# Altium schematic sheet Teensy 3.6 with J1939 - Handheld Rev2.SchDoc: Secure Handheld J1939 Logger
size Letter; Author: Dr. Jeremy Daily; CompanyName: The University of Tulsa; Organization: Mechanical Engineering; Address1: 800 S. Tucker Dr.; Address2: Tulsa, OK 74104; DocumentNumber: Hands-On Heavy Duty Networking; Revision: 1; SheetNumber: 1; SheetTotal: 1
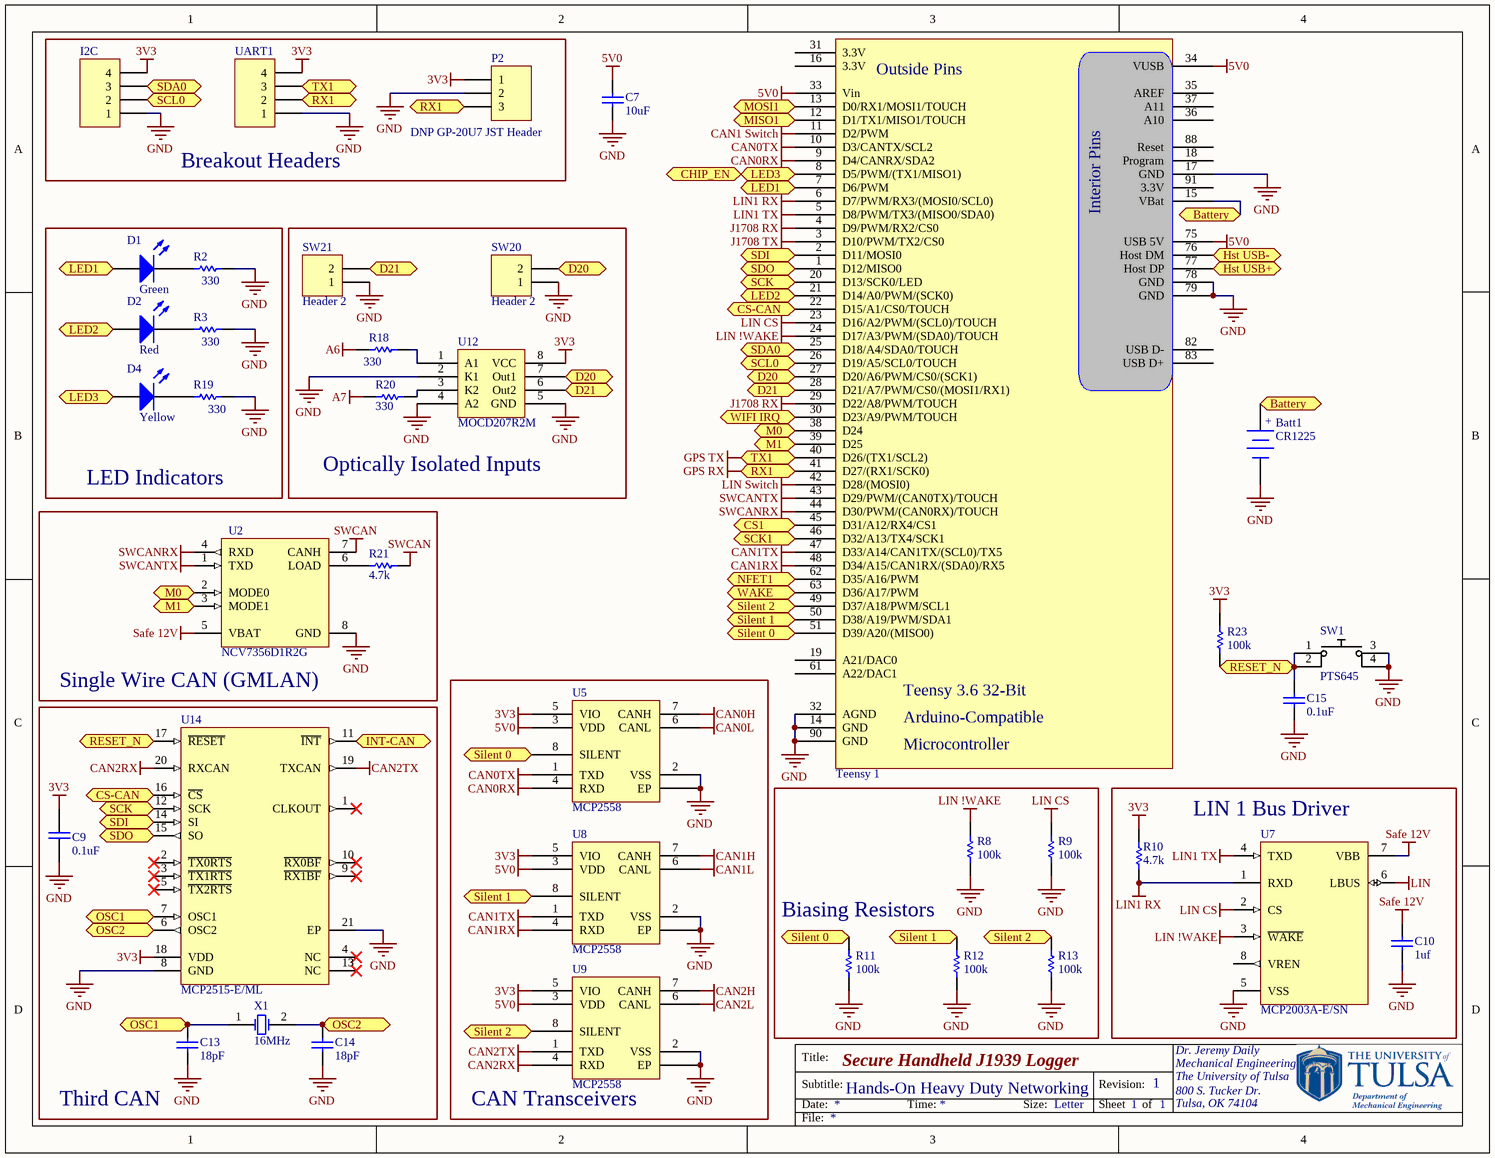
[diagram p0: Teensy 3.6 with J1939 - Handheld Rev2.SchDoc]

## Parts
Batt1  CR1225  [Battery Clip - CR1225]
C7  10uF  [1206]
C9  0.1uF  [0603]
C10  1uf  [0603]
C13  18pF  [0603]
C14  18pF  [0603]
C15  0.1uF  [0603]
D1  Green  [0805 Polarized]
D2  Red  [0805 Polarized]
D4  Yellow  [0805 Polarized]
I2C  Header 4  [HDR1X4]  (value not drawn)
P2  DNP GP-20U7 JST Header  [MHDR1X3]
R2  330  [0603]
R3  330  [0603]
R8  100k  [0603]
R9  100k  [0603]
R10  4.7k  [0603]
R11  100k  [0603]
R12  100k  [0603]
R13  100k  [0603]
R18  330  [0603]
R19  330  [0603]
R20  330  [0603]
R21  4.7k  [0603]
R23  100k  [0603]
SW1  PTS645  [Switch PTS645]
SW20  Header 2  [HDR1X2]
SW21  Header 2  [HDR1X2]
Teensy_1  Teensy 3.6 Through Hole  [Teensy 3.6 Through Hole - No Labels]  (value not drawn)
U2  NCV7356D1R2G  [ONSC-SOIC-8-751-07_V]
U5  MCP2558  [TDFN]
U7  MCP2003A-E/SN  [SOIC-SN8_N]
U8  MCP2558  [TDFN]
U9  MCP2558  [TDFN]
U12  MOCD207R2M  [SOIC-8]
U14  MCP2515-E/ML  [QFN-ML20_M]
UART1  Header 4  [HDR1X4]  (value not drawn)
X1  16MHz  [XTAL 2 pad]

## Blocks framed on the sheet
Breakout Headers: I2C P2 UART1
LED Indicators: D1 D2 D4 R2 R3 R19
Optically Isolated Inputs: R18 R20 SW20 SW21 U12
Single Wire CAN (GMLAN): R21 U2
CAN Transceivers: U5 U8 U9
Third CAN: C9 C13 C14 U14 X1
Biasing Resistors: R8 R9 R11-R13
LIN 1 Bus Driver: C10 R10 U7

## Ports
Battery, CHIP_EN, CS1, CS-CAN, D20, D21, Hst USB+, Hst USB-, INT-CAN, LED1, LED2, LED3, M0, M1, MISO1, MOSI1, NFET1, OSC1, OSC2, RESET_N, RX1, SCK, SCK1, SCL0, SDA0, SDI, SDO, Silent 0, Silent 1, Silent 2, TX1, WAKE, WIFI IRQ

## Nets
3V3: C9.2 I2C.4 P2.1 R10.2 R23.1 U5.5(VIO) U8.5(VIO) U9.5(VIO) U12.8(VCC) U14.18(VDD) UART1.4
5V0: C7.1 Teensy_1.33(Vin) Teensy_1.34(VUSB) Teensy_1.75(USB_5V) U5.3(VDD) U8.3(VDD) U9.3(VDD)
A6: R18.1
A7: R20.1
CAN0H: U5.7(CANH)
CAN0L: U5.6(CANL)
CAN0RX: Teensy_1.9(D4/CANRX/SDA2) U5.4(RXD)
CAN0TX: Teensy_1.10(D3/CANTX/SCL2) U5.1(TXD)
CAN1 Switch: Teensy_1.11(D2/PWM)
CAN1H: U8.7(CANH)
CAN1L: U8.6(CANL)
CAN1RX: Teensy_1.48(D34/A15/CAN1RX/(SDA0)/RX5) U8.4(RXD)
CAN1TX: Teensy_1.47(D33/A14/CAN1TX/(SCL0)/TX5) U8.1(TXD)
CAN2H: U9.7(CANH)
CAN2L: U9.6(CANL)
CAN2RX: U9.4(RXD) U14.20(RXCAN)
CAN2TX: U9.1(TXD) U14.19(TXCAN)
GND: Batt1.2(-) C7.2 C9.1 C10.2 C13.1 C14.1 C15.1 I2C.1 P2.2 R2.2 R3.2 R8.2 R9.2 R11.2 R12.2 R13.2 R19.2 SW1.3 SW1.4 SW20.1 SW21.1 Teensy_1.14(GND) Teensy_1.17(GND) Teensy_1.32(AGND) Teensy_1.78(GND) Teensy_1.79(GND) Teensy_1.90(GND) U2.8(GND) U5.0(EP) U5.2(VSS) U7.5(VSS) U8.0(EP) U8.2(VSS) U9.0(EP) U9.2(VSS) U12.2(K1) U12.4(A2) U12.5(GND) U14.8(GND) U14.21(EP) UART1.1
GPS RX: P2.3 Teensy_1.41(D27/(RX1/SCK0)) UART1.2 ; port RX1
GPS TX: Teensy_1.40(D26/(TX1/SCL2)) UART1.3 ; port TX1
J1708 RX: Teensy_1.4(D9/PWM/RX2/CS0) Teensy_1.29(D22/A8/PWM/TOUCH)
J1708 TX: Teensy_1.3(D10/PWM/TX2/CS0)
LIN: U7.6(LBUS)
LIN1 RX: R10.1 Teensy_1.6(D7/PWM/RX3/(MOSI0/SCL0)) U7.1(RXD)
LIN1 TX: Teensy_1.5(D8/PWM/TX3/(MISO0/SDA0)) U7.4(TXD)
LIN !WAKE: R8.1 Teensy_1.24(D17/A3/PWM/(SDA0)/TOUCH) U7.3(~{WAKE})
LIN CS: R9.1 Teensy_1.23(D16/A2/PWM/(SCL0)/TOUCH) U7.2(CS)
LIN Switch: Teensy_1.42(D28/(MOSI0))
Safe 12V: C10.1 U2.5(VBAT) U7.7(VBB)
SWCAN: R21.2 U2.7(CANH)
SWCANRX: Teensy_1.44(D30/PWM/(CAN0RX)/TOUCH) U2.4(RXD)
SWCANTX: Teensy_1.43(D29/PWM/(CAN0TX)/TOUCH) U2.1(TXD)
Battery: Batt1.1(+) Teensy_1.15(VBat) ; port Battery
CHIP_EN: D4.1(A) Teensy_1.8(D5/PWM/(TX1/MISO1)) ; port LED3, port CHIP_EN
CS1: Teensy_1.45(D31/A12/RX4/CS1) ; port CS1
CS-CAN: Teensy_1.22(D15/A1/CS0/TOUCH) U14.16(~{CS}) ; port CS-CAN
D20: SW20.2 Teensy_1.27(D20/A6/PWM/CS0/(SCK1)) U12.7(Out1) ; port D20
D21: SW21.2 Teensy_1.28(D21/A7/PWM/CS0/(MOSI1/RX1)) U12.6(Out2) ; port D21
Hst USB+: Teensy_1.77(Host_DP) ; port Hst USB+
Hst USB-: Teensy_1.76(Host_DM) ; port Hst USB-
INT-CAN: U14.11(~{INT}) ; port INT-CAN
LED1: D1.1(A) Teensy_1.7(D6/PWM) ; port LED1
LED2: D2.1(A) Teensy_1.21(D14/A0/PWM/(SCK0)) ; port LED2
M0: Teensy_1.38(D24) U2.2(MODE0) ; port M0
M1: Teensy_1.39(D25) U2.3(MODE1) ; port M1
MISO1: Teensy_1.12(D1/TX1/MISO1/TOUCH) ; port MISO1
MOSI1: Teensy_1.13(D0/RX1/MOSI1/TOUCH) ; port MOSI1
NFET1: Teensy_1.62(D35/A16/PWM) ; port NFET1
OSC1: C13.2 U14.7(OSC1) X1.1(OSC1) ; port OSC1
OSC2: C14.2 U14.6(OSC2) X1.2(OSC2) ; port OSC2
RESET_N: C15.2 R23.2 SW1.1 SW1.2 U14.17(~{RESET}) ; port RESET_N
SCK: Teensy_1.20(D13/SCK0/LED) U14.12(SCK) ; port SCK
SCK1: Teensy_1.46(D32/A13/TX4/SCK1) ; port SCK1
SCL0: I2C.2 Teensy_1.26(D19/A5/SCL0/TOUCH) ; port SCL0
SDA0: I2C.3 Teensy_1.25(D18/A4/SDA0/TOUCH) ; port SDA0
SDI: Teensy_1.2(D11/MOSI0) U14.14(SI) ; port SDI
SDO: Teensy_1.1(D12/MISO0) U14.15(SO) ; port SDO
Silent 0: R11.1 Teensy_1.51(D39/A20/(MISO0)) U5.8(SILENT) ; port Silent 0
Silent 1: R12.1 Teensy_1.50(D38/A19/PWM/SDA1) U8.8(SILENT) ; port Silent 1
Silent 2: R13.1 Teensy_1.49(D37/A18/PWM/SCL1) U9.8(SILENT) ; port Silent 2
WAKE: Teensy_1.63(D36/A17/PWM) ; port WAKE
WIFI IRQ: Teensy_1.30(D23/A9/PWM/TOUCH) ; port WIFI IRQ
NetD1_2: D1.2(K) R2.1
NetD2_2: D2.2(K) R3.1
NetD4_2: D4.2(K) R19.1
NetR18_2: R18.2 U12.1(A1)
NetR20_2: R20.2 U12.3(K2)
NetR21_1: R21.1 U2.6(LOAD)

Not connected (* = marked no-connect by the designer): Teensy_1 16(3.3V) 18(Program) 19(A21/DAC0) 31(3.3V) 35(AREF) 36(A10) 37(A11) 61(A22/DAC1) 82(USB_D-) 83(USB_D+) 88(Reset) 91(3.3V); U7 8(VREN); U14 1(CLKOUT)* 2(~{TX0RTS})* 3(~{TX1RTS})* 4(NC)* 5(~{TX2RTS})* 9(~{RX1BF})* 10(~{RX0BF})* 13(NC)*

## Notes on the sheet
- Title:
- Subtitle:
- Date:
- Time:
- Size:
- Letter
- Revision:
- Sheet
- of
- File:
- (in symbol Teensy 3.6 Through Hole) Outside Pins; Interior Pins; Teensy 3.6 32-Bit; Arduino-Compatible; Microcontroller

## Library data of the parts
Batt1 = CR2032 Battery Holder: Lithium Battery Non-Rechargeable (Primary) 3V Coin, 12.5mm; Manufacturer: Linx; PartNumber: BAT-HLD-012-SMT; Supplier 1: Digi-Key; Supplier Part Number 1: BAT-HLD-012-SMT-ND
C7 = Cap: 10µF ±20% 50V Ceramic Capacitor X5R 1206 (3216 Metric); Manufacturer: Murata Electronics North America; PartNumber: GRT31CR61H106ME01L; Supplier 1: Digi-Key; Supplier Part Number 1: 490-12457-1-ND
C9 = Cap: CAP CER 0.1UF 50V X7R 0603; Manufacturer: Murata Electronics North America; PartNumber: GRM188R71H104KA93D; Supplier 1: Digi-Key; Supplier Part Number 1: 490-1519-1-ND
C10 = Cap: 1µF ±20% 50V Ceramic Capacitor X5R 0603 (1608 Metric); Manufacturer: Murata Electronics North America; PartNumber: GRT188R61H105ME13D; Supplier 1: Digi-Key; Supplier Part Number 1: 490-12331-1-ND
C13 C14 = Cap: CAP CER 18PF 50V 5% NP0 0603; Manufacturer: Kemet; PartNumber: C0603C180J5GACTU; Supplier 1: Digi-Key; Supplier Part Number 1: 399-1052-1-ND
C15 = Cap: CAP CER 0.1UF 50V 10% X7R 0603; Manufacturer: Murata Electronics North America; PartNumber: GRM188R71H104KA93D; Supplier 1: Digi-Key; Supplier Part Number 1: 490-1519-1-ND
D1 = LED - SMD: LED GREEN DIFFUSED 0805 SMD; Manufacturer: OSRAM Opto Semiconductors Inc.; PartNumber: LG R971-KN-1; Supplier 1: Digi-Key; Supplier Part Number 1: 475-1410-1-ND
D2 = LED - SMD: LED RED DIFFUSED 0805 SMD; Manufacturer: OSRAM Opto Semiconductors Inc.; PartNumber: LS R976-NR-1; Supplier 1: Digi-Key; Supplier Part Number 1: 475-1278-1-ND
D4 = LED - SMD: LED YELLOW DIFFUSED 0805 SMD; Manufacturer: OSRAM Opto Semiconductors Inc.; PartNumber: LY R976-PS-36; Supplier 1: Digi-Key; Supplier Part Number 1: 475-2560-1-ND
I2C UART1 = Header 4: Header, 4-Pin
P2 = MHDR1X3: CONN HEADER PH SIDE 3POS 2MM SMD; PartNumber: S3B-PH-SM4-TB(LF)(SN); Manufacturer: JST; Supplier 1: Digi-Key; Supplier Part Number 1: 455-1750-1-ND
R2 R3 R18-R20 = Chip Resistor: 330 Ohms ±1% 0.1W, 1/10W Chip Resistor 0603 (1608 Metric) Automotive AEC-Q200, High Voltage Thick Film; Manufacturer: Rohm Semiconductor; PartNumber: KTR03EZPF3300; Supplier 1: Digi-Key; Supplier Part Number 1: RHM330AYCT-ND
R8 R9 R11-R13 R23 = Chip Resistor: ±1% 0.1W, 1/10W Chip Resistor 0603 (1608 Metric) Automotive AEC-Q200, High Voltage Thick Film; Manufacturer: Rohm Semiconductor; PartNumber: KTR03EZPF1003; Supplier 1: Digi-Key; Supplier Part Number 1: RHM100KAYCT-ND
R10 R21 = Chip Resistor: ±1% 0.1W, 1/10W Chip Resistor 0603 (1608 Metric) Automotive AEC-Q200, High Voltage Thick Film; Manufacturer: Rohm Semiconductor; PartNumber: KTR03EZPF4701; Supplier 1: Digi-Key; Supplier Part Number 1: RHM4.7KAYCT-ND
SW1 = Switch - Tactile_1: PTS645 Series  6 mm Tact Switches; Manufacturer: C & K Components; PartNumber: PTS645SM43SMTR92 LFS; Supplier 1: Digi-Key; Supplier Part Number 1: CKN9112CT-ND
SW20 SW21 = Header 2: Header, 2-Pin
Teensy_1 = Teensy 3.6 Through Hole: 24 Position Header Connector 0.100" (2.54mm) Through Hole Gold; Manufacturer: Sullins Connector Solutions; PartNumber: PPPC241LFBN-RC; Supplier 1: Digi-Key; Supplier Part Number 1: S7057-ND
U2 = NCV7356D1G: Single Wire CAN Transceiver, 5 to 27 V, 8-Pin SOIC, Pb-Free, Tube; Manufacturer: On Semiconductor; Supplier 1: Digi-Key; Supplier Part Number 1: NCV7356D1R2GOSCT-ND; PartNumber: NCV7356D1R2G
U5 U8 U9 = MCP2558FD: Microchip CAN FD Transceiver with Silent Mode; PartNumber: MCP2558FDT-H/MNY; Manufacturer: Microchip; Supplier 1: Arrow; Supplier Part Number 1: MCP2558FDT-H/MNY
U7 = MCP2003AT-E/SN: LIN J2602 Transceiver, 8-Pin SOIC, Extended Temperature, Tape and Reel; Manufacturer: Microchip; Supplier 1: Digi-Key; Supplier Part Number 1: MCP2003A-E/SN-ND; PartNumber: MCP2003A-E/SN
U12 = Optoisolator - Dual: Optoisolator Transistor Output 2500Vrms 2 Channel 8-SO Tall; Manufacturer: Fairchild/ON Semiconductor; PartNumber: MOCD207R2M; Supplier 1: Digi-Key; Supplier Part Number 1: MOCD207R2MCT-ND
U14 = MCP2515-E/ML: CAN Controller CAN 2.0 SPI Interface 20-QFN (4x4); Manufacturer: Microchip; PartNumber: MCP2515-E/ML; Supplier 1: Digi-Key; Supplier Part Number 1: MCP2515-E/ML-ND
X1 = Crystal Oscillator: CRYSTAL 16MHZ 18PF SMD; Manufacturer: TXC CORPORATION; PartNumber: 7A-16.000MAAJ-T; Supplier 1: Digi-Key; Supplier Part Number 1: 887-1086-1-ND